# Altium schematic sheet S7CAS-PLEIADES-CARTE-MERE_P01_CLOCK.SchDoc
size Tabloid; DocumentNumber: 4; SheetNumber: 4; SheetTotal: 17; Sheet_Name: CLOCK; Size: 11x17
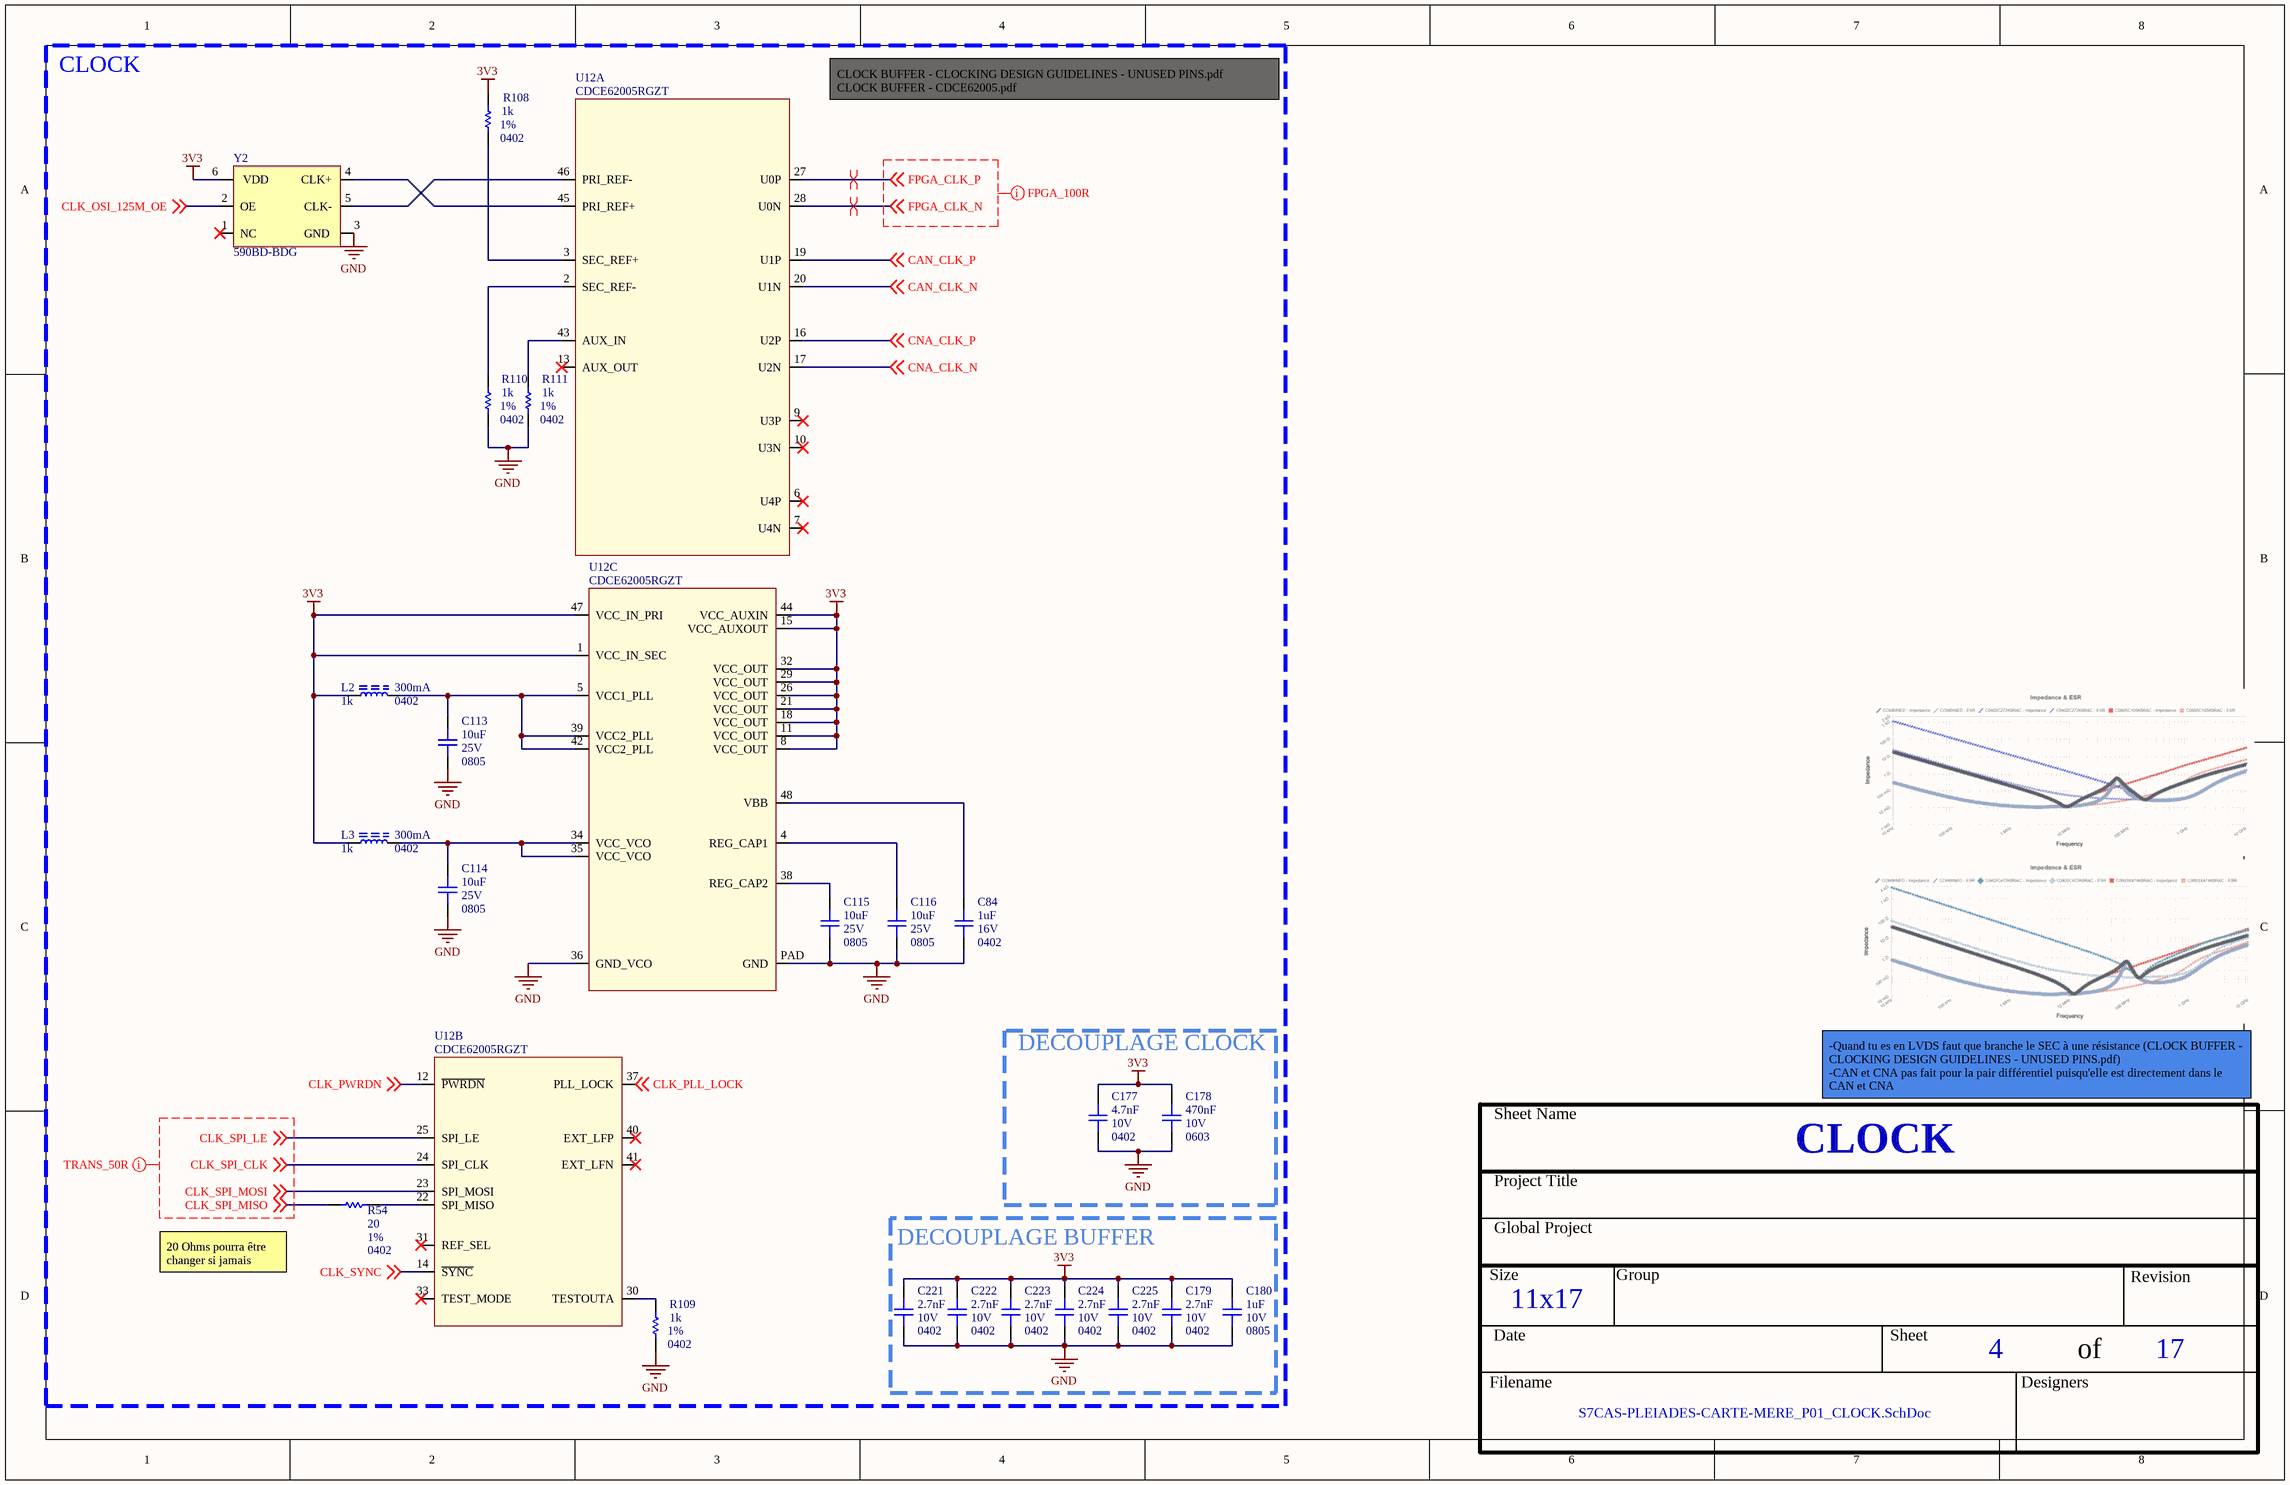
[diagram p0: S7CAS-PLEIADES-CARTE-MERE_P01_CLOCK.SchDoc]

## Parts
C84  value 1uF  Voltage: 16V  Package: 0402  [CAP_0402]  (hidden comment: CAP - 0402)
C113  value 10uF  Voltage: 25V  Package: 0805  [CAP_0805]  (hidden comment: CAP - 0805)
C114  value 10uF  Voltage: 25V  Package: 0805  [CAP_0805]  (hidden comment: CAP - 0805)
C115  value 10uF  Voltage: 25V  Package: 0805  [CAP_0805]  (hidden comment: CAP - 0805)
C116  value 10uF  Voltage: 25V  Package: 0805  [CAP_0805]  (hidden comment: CAP - 0805)
C177  value 4.7nF  Voltage: 10V  Package: 0402  [CAP_0402]  (hidden comment: CAP - 0402)
C178  value 470nF  Voltage: 10V  Package: 0603  [CAP_0603]  (hidden comment: CAP - 0603)
C179  value 2.7nF  Voltage: 10V  Package: 0402  [CAP_0402]  (hidden comment: CAP - 0402)
C180  value 1uF  Voltage: 10V  Package: 0805  [CAP_0805]  (hidden comment: CAP - 0805)
C221  value 2.7nF  Voltage: 10V  Package: 0402  [CAP_0402]  (hidden comment: CAP - 0402)
C222  value 2.7nF  Voltage: 10V  Package: 0402  [CAP_0402]  (hidden comment: CAP - 0402)
C223  value 2.7nF  Voltage: 10V  Package: 0402  [CAP_0402]  (hidden comment: CAP - 0402)
C224  value 2.7nF  Voltage: 10V  Package: 0402  [CAP_0402]  (hidden comment: CAP - 0402)
C225  value 2.7nF  Voltage: 10V  Package: 0402  [CAP_0402]  (hidden comment: CAP - 0402)
L2  value 1k  Current: 300mA  Package: 0402  [FER_0402]  (hidden comment: FER - 0402)
L3  value 1k  Current: 300mA  Package: 0402  [FER_0402]  (hidden comment: FER - 0402)
R54  value 20  Package: 0402  Precision: 1%  [RES_0402]  (hidden comment: RES - 0402)
R108  value 1k  Package: 0402  Precision: 1%  [RES_0402]  (hidden comment: RES - 0402)
R109  value 1k  Package: 0402  Precision: 1%  [RES_0402]  (hidden comment: RES - 0402)
R110  value 1k  Package: 0402  Precision: 1%  [RES_0402]  (hidden comment: RES - 0402)
R111  value 1k  Package: 0402  Precision: 1%  [RES_0402]  (hidden comment: RES - 0402)
U12  CDCE62005RGZT  [TIM_CDCE62005RGZT]  (parts A,B,C of 3)
Y2  590BD-BDG  [OSC_590BD-BDG]

## Blocks framed on the sheet
CLOCK: C84 C113-C116 L2 L3 R54 R108-R111 U12 Y2
DECOUPLAGE CLOCK: C177 C178
DECOUPLAGE BUFFER: C179 C180 C221-C225

## Nets
3V3: C177.2 C178.2 C179.2 C180.2 C221.2 C222.2 C223.2 C224.2 C225.2 L2.2 L3.2 R108.2 U12.1(VCC_IN_SEC) U12.8(VCC_OUT) U12.11(VCC_OUT) U12.15(VCC_AUXOUT) U12.18(VCC_OUT) U12.21(VCC_OUT) U12.26(VCC_OUT) U12.29(VCC_OUT) U12.32(VCC_OUT) U12.44(VCC_AUXIN) U12.47(VCC_IN_PRI) Y2.6(VDD)
GND: C84.1 C113.1 C114.1 C115.1 C116.1 C177.1 C178.1 C179.1 C180.1 C221.1 C222.1 C223.1 C224.1 C225.1 R109.1 R110.1 R111.1 U12.36(GND_VCO) U12.PAD(GND) Y2.3(GND)
CAN_CLK_N: U12.20(U1N) ; off-sheet CAN_CLK_N
CAN_CLK_P: U12.19(U1P) ; off-sheet CAN_CLK_P
CLK_OSI_125M_OE: Y2.2(OE) ; off-sheet CLK_OSI_125M_OE
CLK_PLL_LOCK: U12.37(PLL_LOCK) ; off-sheet CLK_PLL_LOCK
CLK_PWRDN: U12.12(~{PWRDN}) ; off-sheet CLK_PWRDN
CLK_SPI_CLK: U12.24(SPI_CLK) ; off-sheet CLK_SPI_CLK
CLK_SPI_LE: U12.25(SPI_LE) ; off-sheet CLK_SPI_LE
CLK_SPI_MISO: R54.2 ; off-sheet CLK_SPI_MISO
CLK_SPI_MOSI: U12.23(SPI_MOSI) ; off-sheet CLK_SPI_MOSI
CLK_SYNC: U12.14(~{SYNC}) ; off-sheet CLK_SYNC
CNA_CLK_N: U12.17(U2N) ; off-sheet CNA_CLK_N
CNA_CLK_P: U12.16(U2P) ; off-sheet CNA_CLK_P
FPGA_CLK_N: U12.28(U0N) ; off-sheet FPGA_CLK_N
FPGA_CLK_P: U12.27(U0P) ; off-sheet FPGA_CLK_P
NetC84_2: C84.2 U12.48(VBB)
NetC113_2: C113.2 L2.1 U12.5(VCC1_PLL) U12.39(VCC2_PLL) U12.42(VCC2_PLL)
NetC114_2: C114.2 L3.1 U12.34(VCC_VCO) U12.35(VCC_VCO)
NetC115_2: C115.2 U12.38(REG_CAP2)
NetC116_2: C116.2 U12.4(REG_CAP1)
NetR54_1: R54.1 U12.22(SPI_MISO)
NetR108_1: R108.1 U12.3(SEC_REF+)
NetR109_2: R109.2 U12.30(TESTOUTA)
NetR110_2: R110.2 U12.2(SEC_REF-)
NetR111_2: R111.2 U12.43(AUX_IN)
NetU12_45: U12.45(PRI_REF+) Y2.4(CLK+)
NetU12_46: U12.46(PRI_REF-) Y2.5(CLK-)

Not connected (* = marked no-connect by the designer): U12 6(U4P)* 7(U4N)* 9(U3P)* 10(U3N)* 13(AUX_OUT)* 31(REF_SEL)* 33(TEST_MODE)* 40(EXT_LFP)* 41(EXT_LFN)*; Y2 1(NC)*

## Layout directives
net class FPGA_100R: FPGA_CLK_N, FPGA_CLK_P
differential pair: FPGA_CLK_N, FPGA_CLK_P
net class TRANS_50R: CLK_SPI_CLK, CLK_SPI_LE, CLK_SPI_MISO, CLK_SPI_MOSI

## Notes on the sheet
- CLOCK BUFFER - CLOCKING DESIGN GUIDELINES - UNUSED PINS.pdf
  CLOCK BUFFER - CDCE62005.pdf
- -Quand tu es en LVDS faut que branche le SEC à une résistance (CLOCK BUFFER - CLOCKING DESIGN GUIDELINES - UNUSED PINS.pdf)
  -CAN et CNA pas fait pour la pair différentiel puisqu'elle est directement dans le CAN et CNA
- 20 Ohms pourra être changer si jamais
- Sheet Name
- Project Title
- Global Project
- Size
- Group
- Revision
- Date
- Sheet
- of
- Filename
- Designers

## Library data of the parts
C84 = CAP - 0402: 1 µF ±10% 16V Ceramic Capacitor X5R 0402 (1005 Metric); Mfg Part Number: CL05A105KO5NNNC; Mfg: Samsung Electro-Mechanics; Current: *; CreatedBy: Jonathan Bouchard; Power: *; Precision: 10%
C113-C116 = CAP - 0805: 10 µF ±10% 25V Ceramic Capacitor X5R 0805 (2012 Metric); Mfg Part Number: CL21A106KAYNNNE; Mfg: Samsung Electro-Mechanics; Current: *; CreatedBy: Jonathan Bouchard; Power: *; Precision: 10%; Part Number #1: CL21A106KAYNNNE
C177 = CAP - 0402: Mfg Part Number: C0402C472K8RAC; Precision: 10%; Current: *; CreatedBy: Jonathan Bouchard; Power: *
C178 = CAP - 0603: Mfg Part Number: C0603X474K8RAC; Precision: 10%; Current: *; CreatedBy: Jonathan Bouchard; Power: *
C179 C221-C225 = CAP - 0402: Mfg Part Number: C0402C272K8RAC; Precision: 10%; Current: *; CreatedBy: Jonathan Bouchard; Power: *
C180 = CAP - 0805: Mfg Part Number: C0805C105K8RAC; Precision: 10%; Current: *; CreatedBy: Jonathan Bouchard; Power: *
L2 L3 = FER - 0402: 1 kOhms @ 100 MHz 1 Ferrite Bead 0402 (1005 Metric) 300mA 650mOhm; Mfg Part Number: BLM15AG102SN1D; Mfg: Murata Electronics; Voltage: *; CreatedBy: Jonathan Bouchard; Power: *; Precision: *; Part Number #1: BLM15AG102SN1D
R54 = RES - 0402: 20 Ohms ±1% 0.063W, 1/16W Chip Resistor 0402 (1005 Metric) Moisture Resistant Thick Film; Mfg Part Number: RC0402FR-0720RL; Voltage: 75V; Current: *; CreatedBy: Jonathan Bouchard; Power: 1/16W; Part Number #1: RC0402FR-0720RL
R108-R111 = RES - 0402: 1 kOhms ±1% 0.1W, 1/10W Chip Resistor 0402 (1005 Metric) Automotive AEC-Q200 Thick Film; Mfg Part Number: ERJ-2RKF1001X; Voltage: 50V; Mfg: Panasonic Electronic Components; Current: *; CreatedBy: Jonathan Bouchard; Power: 1/10W; Part Number #1: ERJ-2RKF1001X
U12 = TIM_CDCE62005RGZT: TIM - CLK SYNTH JITTER CLEANER 3:5 - QFN-48; Voltage: 3 V ~ 3.6 V; Mfg: Texas Instruments; Current: *; Power: *; Mfg Part Number: CDCE62005RGZT; HelpURL: http://www.ti.com/lit/ds/symlink/cdce62005.pdf; CreatedBy: Jonathan Bouchard; Temperature: -40°C ~ 85°C; Value: *; Precision: *; Package: QFN-48; Supplier 1: Digikey; Supplier Part Number 1: 296-23947-1-ND
Y2 = OSC_590BD-BDG: TIM - OSC PROG 125MHz ~ 214.999MHz LVDS 3.3V 7PPM EN/DS - 6-SMD; Manufacturer #1: Silicon Labs; Current Rating: 100 mA (supply); Voltage rating: 3.3V (supply); Polarized: Yes; Value: ±7ppm (freq Stability), ±20ppm (freq stability total); Magnetic Material: UNKNOWN; GRAMS Lib Spec: 2.8; Manufacturer #2: *; Power Max: *; Part Number #1: 590BD-BDG; Part Number #2: *; HelpURL: https://www.silabs.com/documents/public/data-sheets/Si590-591.pdf; Supplier 1: Digi-Key; Supplier Part Number 1: 590BD-BDG-ND; Temperature: -40°C ~ 85°C; Package: 6-SMD; CreatedBy/Date: from 590BD-CDG; Tolerance: *; VerifiedBy: Caroline Paulin / 3/10/2019; Cryo: UNKNOWN; Mfg Part Number: 590BD-BDG